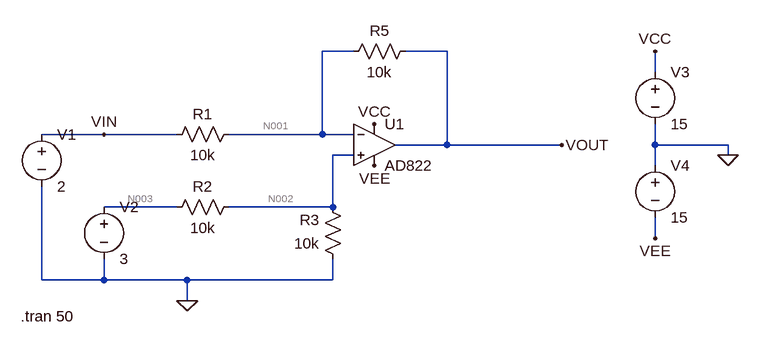
[diagram p0: schematic Differential_Amplifier.asc]
Differential_Amplifier.asc, the LTspice schematic file:
Version 4
SHEET 1 880 680
WIRE 192 16 144 16
WIRE 336 16 272 16
WIRE 656 48 656 16
WIRE -192 144 -288 144
WIRE -80 144 -192 144
WIRE 144 144 144 16
WIRE 144 144 0 144
WIRE 192 144 144 144
WIRE 336 160 336 16
WIRE 336 160 256 160
WIRE 512 160 336 160
WIRE 656 160 656 128
WIRE 768 160 656 160
WIRE 192 176 160 176
WIRE 768 176 768 160
WIRE 656 192 656 160
WIRE -80 256 -192 256
WIRE 160 256 160 176
WIRE 160 256 0 256
WIRE 656 304 656 272
WIRE -288 368 -288 224
WIRE -192 368 -192 336
WIRE -192 368 -288 368
WIRE -64 368 -192 368
WIRE 160 368 160 336
WIRE 160 368 -64 368
WIRE -64 400 -64 368
FLAG -64 400 0
FLAG 224 128 VCC
FLAG 224 192 VEE
FLAG 768 176 0
FLAG 656 16 VCC
FLAG 656 304 VEE
FLAG -192 144 VIN
FLAG 512 160 VOUT
SYMBOL AD822 224 96 R0
SYMATTR InstName U1
SYMBOL res 16 128 R90
WINDOW 0 0 56 VBottom 2
WINDOW 3 32 56 VTop 2
SYMATTR InstName R1
SYMATTR Value 10k
SYMBOL res 16 240 R90
WINDOW 0 0 56 VBottom 2
WINDOW 3 32 56 VTop 2
SYMATTR InstName R2
SYMATTR Value 10k
SYMBOL res 176 352 R180
WINDOW 0 36 76 Left 2
WINDOW 3 36 40 Left 2
SYMATTR InstName R3
SYMATTR Value 10k
SYMBOL voltage -288 128 R0
SYMATTR InstName V1
SYMATTR Value 2
SYMBOL voltage -192 240 R0
SYMATTR InstName V2
SYMATTR Value 3
SYMBOL res 288 0 R90
WINDOW 0 0 56 VBottom 2
WINDOW 3 32 56 VTop 2
SYMATTR InstName R5
SYMATTR Value 10k
SYMBOL voltage 656 32 R0
SYMATTR InstName V3
SYMATTR Value 15
SYMBOL voltage 656 176 R0
WINDOW 123 0 0 Left 0
WINDOW 39 0 0 Left 0
SYMATTR InstName V4
SYMATTR Value 15
TEXT -320 424 Left 2 !.tran 50

The netlist it stands for:
* Differential_Amplifier.asc
* U1: AD822 (symbol AD822 not available, pins judged from their places): In+=N002 In-=N001 V+=VCC V-=VEE OUT=VOUT
R1 N001 VIN 10k
R2 N002 N003 10k
R3 0 N002 10k
V1 VIN 0 2
V2 N003 0 3
R5 VOUT N001 10k
V3 VCC 0 15
V4 0 VEE 15
.tran 50
.backanno
.end

* Results of the author's LTspice run, read from the files saved beside the schematic
* Operating Point, zero values left out:
*   V(vcc) = 15 V
*   V(vee) = -15 V
*   V(n001) = 1.5 V
*   V(n002) = 1.5 V
*   V(vout) = 1 V
*   V(vin) = 2 V
*   V(n003) = 3 V
*   I(R5) = -50 µA
*   I(R3) = -150 µA
*   I(R2) = -150 µA
*   I(R1) = -50 µA
*   I(V4) = -757 µA
*   I(V3) = -707 µA
*   I(V2) = -150 µA
*   I(V1) = -50 µA
*   Ix(u1:1) = 2.075 pA
*   Ix(u1:2) = 2.075 pA
*   Ix(u1:3) = 707 µA
*   Ix(u1:4) = -757 µA
*   Ix(u1:5) = 50 µA